# Altium schematic sheet C_20.SchDoc
size A3
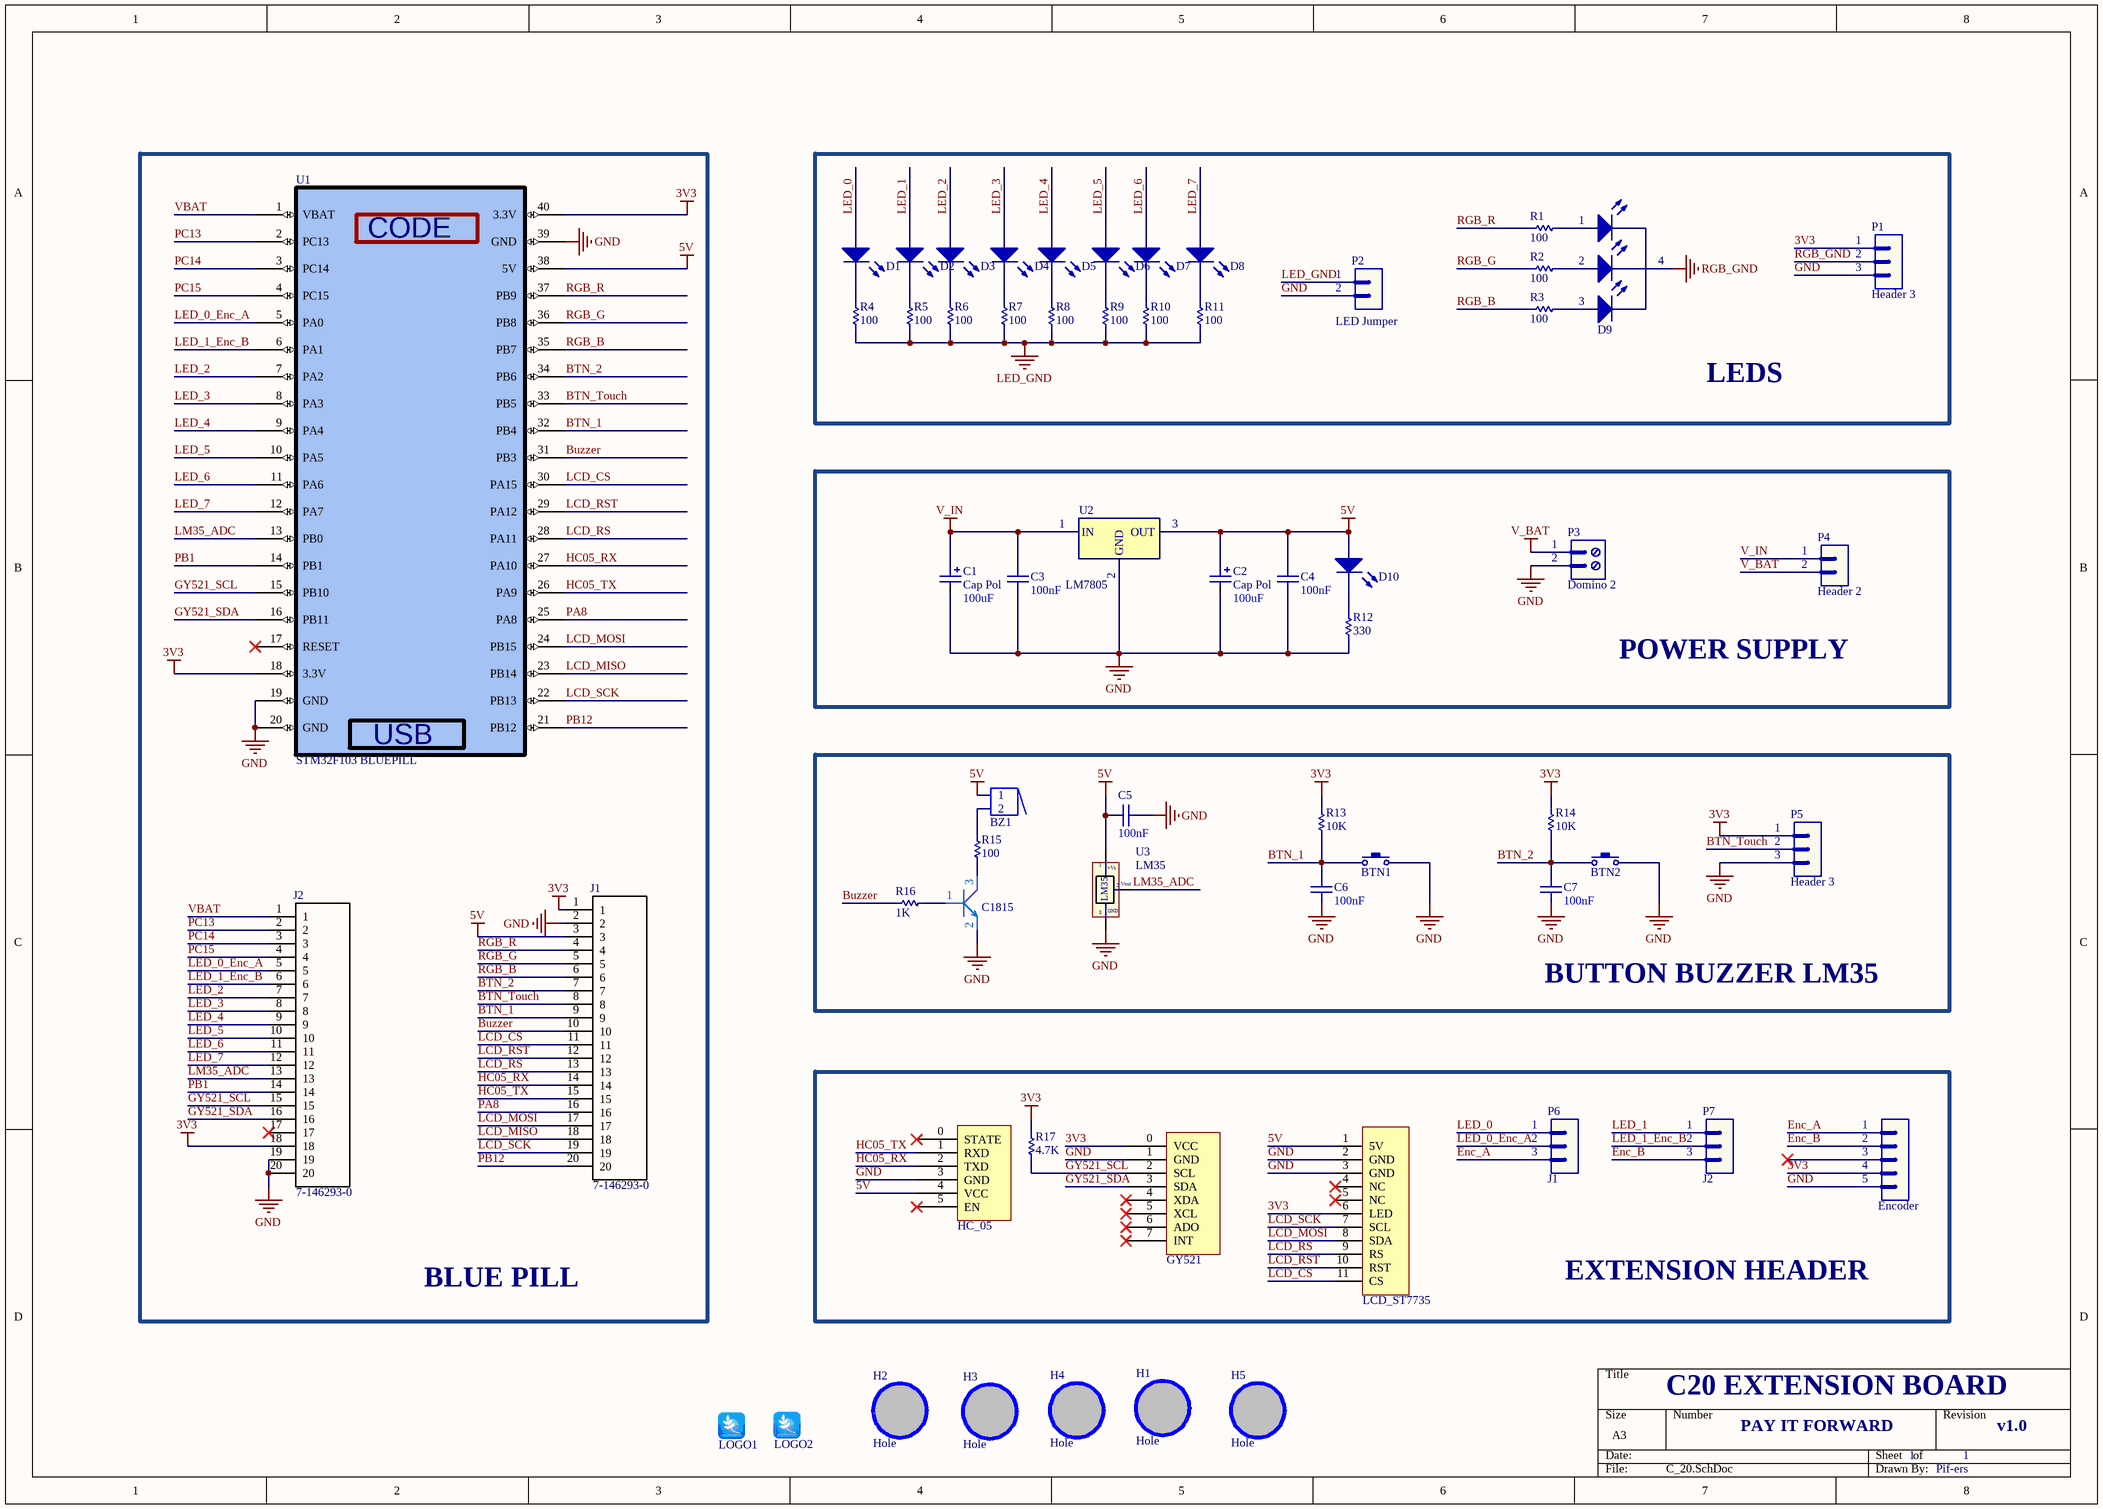
[diagram p0: C_20.SchDoc]

## Parts
BTN1  Button  [Button]  (value not drawn)
BTN2  Button  [Button]  (value not drawn)
BZ1  Buzzer  [BUZZER]  (value not drawn)
C1  Cap Pol  value 100uF  [CP1/2]
C2  Cap Pol  value 100uF  [CP1/2]
C3  value 100nF  [CAP-SM-0805]  (hidden comment: Cap Non-Pol SMD)
C4  value 100nF  [CAP-SM-0805]  (hidden comment: Cap Non-Pol SMD)
C5  value 100nF  [CAP-SM-0805]  (hidden comment: Cap Non-Pol SMD)
C6  value 100nF  [CAP-SM-0805]  (hidden comment: Cap Non-Pol SMD)
C7  value 100nF  [CAP-SM-0805]  (hidden comment: Cap Non-Pol SMD)
C8  C1815  [C1815_SMD]
D1  LED  [LED-3mm]  (value not drawn)
D2  LED  [LED-3mm]  (value not drawn)
D3  LED  [LED-3mm]  (value not drawn)
D4  LED  [LED-3mm]  (value not drawn)
D5  LED  [LED-3mm]  (value not drawn)
D6  LED  [LED-3mm]  (value not drawn)
D7  LED  [LED-3mm]  (value not drawn)
D8  LED  [LED-3mm]  (value not drawn)
D9  LED RGB  [LED RGB]  (value not drawn)
D10  LED  [LED-3mm]  (value not drawn)
Encoder  Encoder  [JP5]
H1  Hole  [LO KHOAN 3MM]
H2  Hole  [LO KHOAN 3MM]
H3  Hole  [LO KHOAN 3MM]
H4  Hole  [LO KHOAN 3MM]
H5  Hole  [LO KHOAN 3MM]
HC_05  HC_05  [HC_05]
J1  7-146293-0  [*TE_7-146293-0]
J2  7-146293-0  [*TE_7-146293-0]
LCD_ST7735  LCD_ST7735  [LCD_ST7735]
LOGO1  LOGO PIF  [PIF LOGO TOP OVERLAY]  (value not drawn)
LOGO2  LOGO PIF  [PIF LOGO BOTTOM LAYER]  (value not drawn)
MPU6050  GY521  [GY521_MPU6050]
P1  Header 3  [JP3]
P2  LED Jumper  [JP2]
P3  Domino 2  [DOMINO 2- 5mm]
P4  Header 2  [JP2]
P5  Header 3  [JP3]
P6  J1  [JP3]
P7  J2  [JP3]
R1  value 100  [RES-SM-0805]  (hidden comment: Resistor 1/4W)
R2  value 100  [RES-SM-0805]  (hidden comment: Resistor 1/4W)
R3  value 100  [RES-SM-0805]  (hidden comment: Resistor 1/4W)
R4  value 100  [RES-SM-0805]  (hidden comment: Resistor 1/4W)
R5  value 100  [RES-SM-0805]  (hidden comment: Resistor 1/4W)
R6  value 100  [RES-SM-0805]  (hidden comment: Resistor 1/4W)
R7  value 100  [RES-SM-0805]  (hidden comment: Resistor 1/4W)
R8  value 100  [RES-SM-0805]  (hidden comment: Resistor 1/4W)
R9  value 100  [RES-SM-0805]  (hidden comment: Resistor 1/4W)
R10  value 100  [RES-SM-0805]  (hidden comment: Resistor 1/4W)
R11  value 100  [RES-SM-0805]  (hidden comment: Resistor 1/4W)
R12  value 330  [RES-SM-0805]  (hidden comment: Resistor 1/4W)
R13  value 10K  [RES-SM-0805]  (hidden comment: Resistor 1/4W)
R14  value 10K  [RES-SM-0805]  (hidden comment: Resistor 1/4W)
R15  value 100  [RES-SM-0805]  (hidden comment: Resistor 1/4W)
R16  value 1K  [RES-SM-0805]  (hidden comment: Resistor 1/4W)
R17  value 4.7K  [RES-SM-0805]  (hidden comment: Resistor 1/4W)
U1  STM32F103 BLUEPILL  [STM32F103 Bluepill]
U2  LM7805  [QTO-220]
U3  LM35  [QTO-92]

## Blocks framed on the sheet
BLUE PILL: J1 J2 U1
LEDS: D1-D9 P1 P2 R1-R11
POWER SUPPLY: C1-C4 D10 P3 P4 R12 U2
BUTTON BUZZER LM35: BTN1 BTN2 BZ1 C5-C8 P5 R13-R16 U3
EXTENSION HEADER: Encoder HC_05 LCD_ST7735 MPU6050 P6 P7 R17

## Nets
3V3: Encoder.4 J1.1 J2.18 LCD_ST7735.6(LED) MPU6050.0(VCC) P1.1 P5.1 R13.2 R14.2 R17.2 U1.18(3.3V) U1.40(3.3V)
5V: BZ1.1 C2.1 C4.2 C5.1 D10.1(A) HC_05.4(VCC) J1.3 LCD_ST7735.1(5V) U1.38(5V) U2.3(OUT) U3.1(+Vs)
GND: BTN1.2 BTN2.2 C1.2 C2.2 C3.1 C4.1 C5.2 C6.1 C7.1 C8.2(C) Encoder.5 HC_05.3(GND) J1.2 J2.19 J2.20 LCD_ST7735.2(GND) LCD_ST7735.3(GND) MPU6050.1(GND) P1.3 P2.2 P3.2 P5.3 R12.1 U1.19(GND) U1.20(GND) U1.39(GND) U2.2(GND) U3.3(-)
LED_GND: P2.1 R4.1 R5.1 R6.1 R7.1 R8.1 R9.1 R10.1 R11.1
RGB_GND: D9.4(Anod) P1.2
V_BAT: P3.1 P4.2
V_IN: C1.1 C3.2 P4.1 U2.1(IN)
BTN_1: BTN1.1 C6.2 J1.9 R13.1 U1.32(PB4)
BTN_2: BTN2.1 C7.2 J1.7 R14.1 U1.34(PB6)
BTN_Touch: J1.8 P5.2 U1.33(PB5)
Buzzer: J1.10 R16.1 U1.31(PB3)
Enc_A: Encoder.1 P6.3
Enc_B: Encoder.2 P7.3
GY521_SCL: J2.15 MPU6050.2(SCL) R17.1 U1.15(PB10)
GY521_SDA: J2.16 MPU6050.3(SDA) U1.16(PB11)
HC05_RX: HC_05.2(TXD) J1.14 U1.27(PA10)
HC05_TX: HC_05.1(RXD) J1.15 U1.26(PA9)
LCD_CS: J1.11 LCD_ST7735.11(CS) U1.30(PA15)
LCD_MISO: J1.18 U1.23(PB14)
LCD_MOSI: J1.17 LCD_ST7735.8(SDA) U1.24(PB15)
LCD_RS: J1.13 LCD_ST7735.9(RS) U1.28(PA11)
LCD_RST: J1.12 LCD_ST7735.10(RST) U1.29(PA12)
LCD_SCK: J1.19 LCD_ST7735.7(SCL) U1.22(PB13)
LED_0: D1.1(A) P6.1
LED_0_Enc_A: J2.5 P6.2 U1.5(PA0)
LED_1: D2.1(A) P7.1
LED_1_Enc_B: J2.6 P7.2 U1.6(PA1)
LED_2: D3.1(A) J2.7 U1.7(PA2)
LED_3: D4.1(A) J2.8 U1.8(PA3)
LED_4: D5.1(A) J2.9 U1.9(PA4)
LED_5: D6.1(A) J2.10 U1.10(PA5)
LED_6: D7.1(A) J2.11 U1.11(PA6)
LED_7: D8.1(A) J2.12 U1.12(PA7)
LM35_ADC: J2.13 U1.13(PB0) U3.2(Vout)
PA8: J1.16 U1.25(PA8)
PB1: J2.14 U1.14(PB1)
PB12: J1.20 U1.21(PB12)
PC13: J2.2 U1.2(PC13)
PC14: J2.3 U1.3(PC14)
PC15: J2.4 U1.4(PC15)
RGB_B: J1.6 R3.1 U1.35(PB7)
RGB_G: J1.5 R2.1 U1.36(PB8)
RGB_R: J1.4 R1.1 U1.37(PB9)
VBAT: J2.1 U1.1(VBAT)
NetBZ1_2: BZ1.2 R15.2
NetC8_1: C8.1(B) R16.2
NetC8_3: C8.3(C) R15.1
NetD1_2: D1.2(K) R4.2
NetD2_2: D2.2(K) R5.2
NetD3_2: D3.2(K) R6.2
NetD4_2: D4.2(K) R7.2
NetD5_2: D5.2(K) R8.2
NetD6_2: D6.2(K) R9.2
NetD7_2: D7.2(K) R10.2
NetD8_2: D8.2(K) R11.2
NetD9_1: D9.1(Anod) R1.2
NetD9_2: D9.2(Anod) R2.2
NetD9_3: D9.3(Anod) R3.2
NetD10_2: D10.2(K) R12.2

Not connected (* = marked no-connect by the designer): Encoder 3*; H1 1; H2 1; H3 1; H4 1; H5 1; HC_05 0(STATE)* 5(EN)*; J2 17*; LCD_ST7735 4(NC)* 5(NC)*; MPU6050 4(XDA)* 5(XCL)* 6(ADO)* 7(INT)*; U1 17(RESET)*

## Notes on the sheet
- C20 EXTENSION BOARD
- PAY IT FORWARD
- 1
- v1.0
- Pif-ers
- (in symbol LM35) GND
- (in symbol STM32F103 BLUEPILL) CODE; USB

## Library data of the parts
C1 C2 = Cap Pol: Polarized Capacitor (Radial)
C3-C7 = Cap Non-Pol SMD: Capacitor
Encoder = Header 5: Header, 5-Pin; LatestRevisionDate: 17-Jul-2002; LatestRevisionNote: Re-released for DXP Platform.; Publisher: Altium Limited
H1-H5 = Hole: Hole 3mm
MPU6050 = GY521_MPU6050
P1 P5-P7 = Header 3: Header, 3-Pin; LatestRevisionDate: 17-Jul-2002; LatestRevisionNote: Re-released for DXP Platform.; Publisher: Altium Limited
P2 P4 = Header 2: Header, 2-Pin; LatestRevisionDate: 17-Jul-2002; LatestRevisionNote: Re-released for DXP Platform.; Publisher: Altium Limited
P3 = Domino 2: Domino, 2-Pin; LatestRevisionDate: 17-Jul-2002; LatestRevisionNote: Re-released for DXP Platform.; Publisher: Altium Limited
R1-R17 = RES
U2 = LM7805: Positive Voltage Regulator
U3 = LM35: Teminal; Value: LM35
J1 J2 = 7-146293-0: Value: *